# Altium schematic sheet SOC - MCU DOMAIN.SchDoc
size A2; DocumentNumber: 7; SheetNumber: 8; SheetTotal: 14
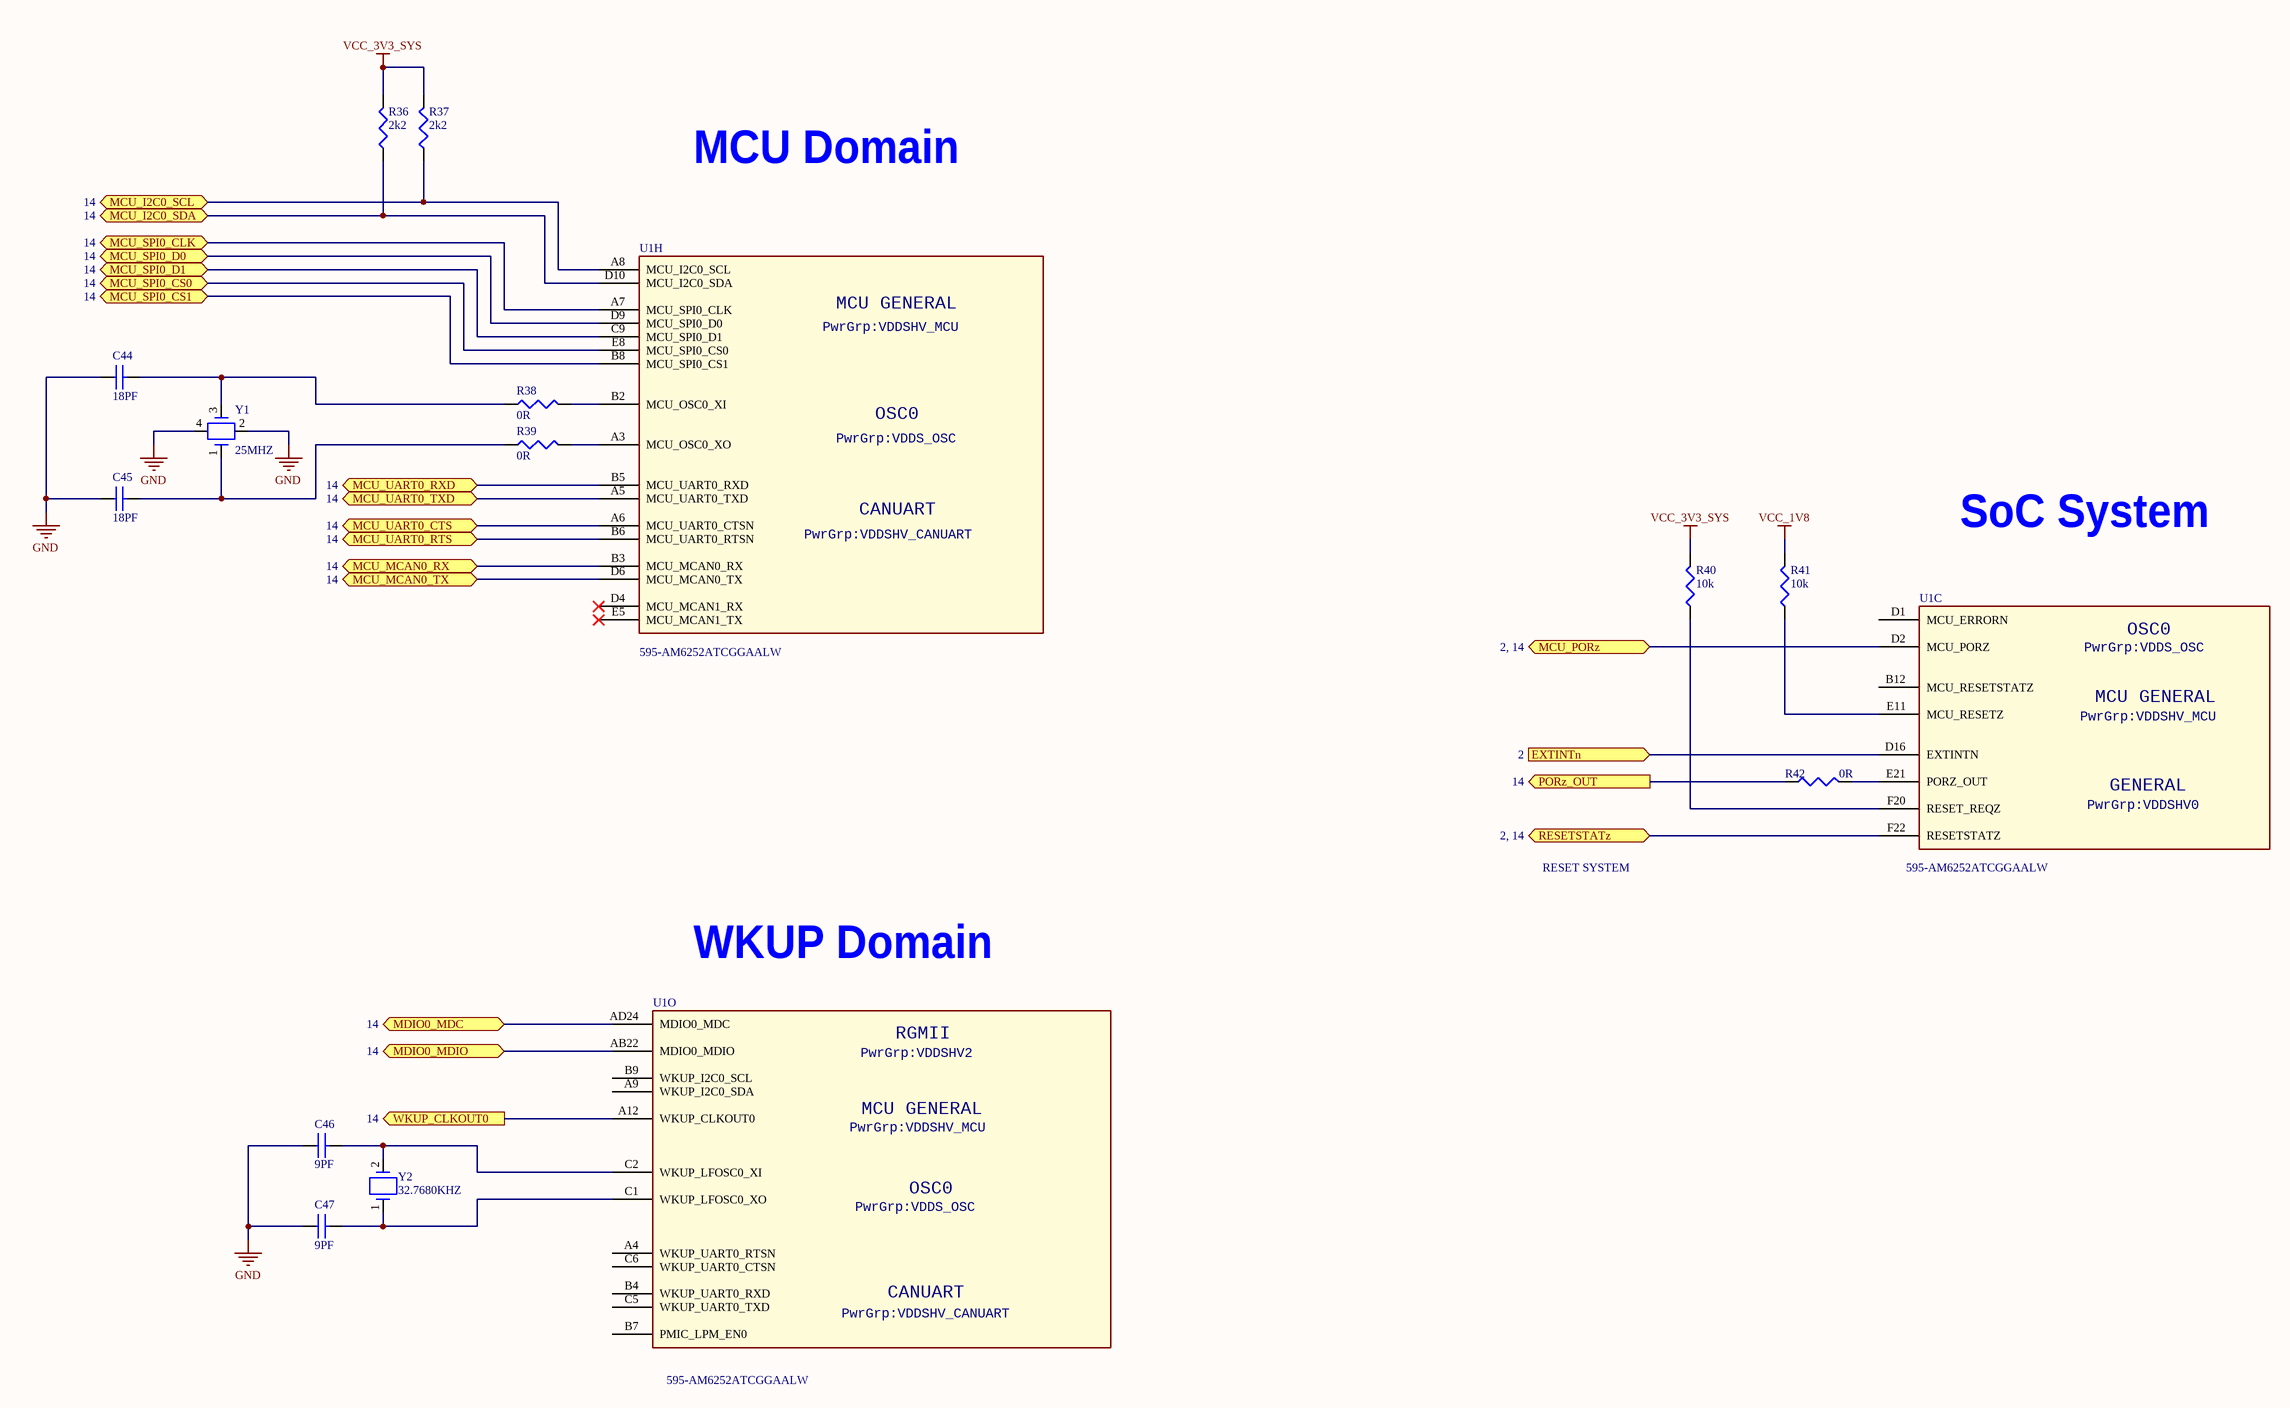
[diagram p0: SOC - MCU DOMAIN.SchDoc]

## Parts
C44  18PF  [C0402]
C45  18PF  [C0402]
C46  9PF  [C0402]
C47  9PF  [C0402]
R36  2k2  [R0402]
R37  2k2  [R0402]
R38  0R  [R0402]
R39  0R  [R0402]
R40  10k  [R0201]
R41  10k  [R0201]
R42  0R  [R0402]
U1  Supplier Part Number 1: 595-AM6252ATCGGAALW  [BGA425C50P25X25_1300X1300X89]  (hidden comment: AM62-EVM_BGA425)  (parts C,H,O of 18)
Y1  25MHZ  [XRCGB25M000F3M00R0]
Y2  32.7680KHZ  [ECS327934QSTR]

## Ports
EXTINTn (in, see 2), MCU_I2C0_SCL (bidir, see 14), MCU_I2C0_SDA (bidir, see 14), MCU_MCAN0_RX (bidir, see 14), MCU_MCAN0_TX (bidir, see 14), MCU_PORz (bidir, see 2, 14), MCU_SPI0_CLK (bidir, see 14), MCU_SPI0_CS0 (bidir, see 14), MCU_SPI0_CS1 (bidir, see 14), MCU_SPI0_D0 (bidir, see 14), MCU_SPI0_D1 (bidir, see 14), MCU_UART0_CTS (bidir, see 14), MCU_UART0_RTS (bidir, see 14), MCU_UART0_RXD (bidir, see 14), MCU_UART0_TXD (bidir, see 14), MDIO0_MDC (bidir, see 14), MDIO0_MDIO (bidir, see 14), PORz_OUT (out, see 14), RESETSTATz (bidir, see 2, 14), WKUP_CLKOUT0 (out, see 14)

## Nets
GND: C44.1 C45.1 C46.1 C47.1 Y1.2 Y1.4
VCC_1V8: R41.2
VCC_3V3_SYS: R36.2 R37.2 R40.2
EXTINTn: U1.D16(EXTINTN) ; port EXTINTn
MCU_I2C0_SCL: R37.1 U1.A8(MCU_I2C0_SCL) ; port MCU_I2C0_SCL
MCU_I2C0_SDA: R36.1 U1.D10(MCU_I2C0_SDA) ; port MCU_I2C0_SDA
MCU_MCAN0_RX: U1.B3(MCU_MCAN0_RX) ; port MCU_MCAN0_RX
MCU_MCAN0_TX: U1.D6(MCU_MCAN0_TX) ; port MCU_MCAN0_TX
MCU_PORz: U1.D2(MCU_PORZ) ; port MCU_PORz
MCU_SPI0_CLK: U1.A7(MCU_SPI0_CLK) ; port MCU_SPI0_CLK
MCU_SPI0_CS0: U1.E8(MCU_SPI0_CS0) ; port MCU_SPI0_CS0
MCU_SPI0_CS1: U1.B8(MCU_SPI0_CS1) ; port MCU_SPI0_CS1
MCU_SPI0_D0: U1.D9(MCU_SPI0_D0) ; port MCU_SPI0_D0
MCU_SPI0_D1: U1.C9(MCU_SPI0_D1) ; port MCU_SPI0_D1
MCU_UART0_CTS: U1.A6(MCU_UART0_CTSN) ; port MCU_UART0_CTS
MCU_UART0_RTS: U1.B6(MCU_UART0_RTSN) ; port MCU_UART0_RTS
MCU_UART0_RXD: U1.B5(MCU_UART0_RXD) ; port MCU_UART0_RXD
MCU_UART0_TXD: U1.A5(MCU_UART0_TXD) ; port MCU_UART0_TXD
MDIO0_MDC: U1.AD24(MDIO0_MDC) ; port MDIO0_MDC
MDIO0_MDIO: U1.AB22(MDIO0_MDIO) ; port MDIO0_MDIO
PORz_OUT: R42.1 ; port PORz_OUT
RESETSTATz: U1.F22(RESETSTATZ) ; port RESETSTATz
WKUP_CLKOUT0: U1.A12(WKUP_CLKOUT0) ; port WKUP_CLKOUT0
NetC44_2: C44.2 R38.1 Y1.3
NetC45_2: C45.2 R39.1 Y1.1
NetC46_2: C46.2 U1.C2(WKUP_LFOSC0_XI) Y2.2
NetC47_2: C47.2 U1.C1(WKUP_LFOSC0_XO) Y2.1
NetR38_2: R38.2 U1.B2(MCU_OSC0_XI)
NetR39_2: R39.2 U1.A3(MCU_OSC0_XO)
NetR40_1: R40.1 U1.F20(RESET_REQZ)
NetR41_1: R41.1 U1.E11(MCU_RESETZ)
NetR42_2: R42.2 U1.E21(PORZ_OUT)

Not connected (* = marked no-connect by the designer): U1 A4(WKUP_UART0_RTSN) A9(WKUP_I2C0_SDA) B4(WKUP_UART0_RXD) B7(PMIC_LPM_EN0) B9(WKUP_I2C0_SCL) B12(MCU_RESETSTATZ) C5(WKUP_UART0_TXD) C6(WKUP_UART0_CTSN) D1(MCU_ERRORN) D4(MCU_MCAN1_RX)* E5(MCU_MCAN1_TX)*

## Notes on the sheet
- MCU Domain
- SoC System
- RESET SYSTEM
- WKUP Domain
- (in symbol AM62-EVM_BGA425, part C) OSC0; PwrGrp:VDDS_OSC; MCU GENERAL; PwrGrp:VDDSHV_MCU; GENERAL; PwrGrp:VDDSHV0
- (in symbol AM62-EVM_BGA425, part H) MCU GENERAL; PwrGrp:VDDSHV_MCU; OSC0; PwrGrp:VDDS_OSC; CANUART; PwrGrp:VDDSHV_CANUART
- (in symbol AM62-EVM_BGA425, part O) RGMII; PwrGrp:VDDSHV2; MCU GENERAL; PwrGrp:VDDSHV_MCU; OSC0; PwrGrp:VDDS_OSC; CANUART; PwrGrp:VDDSHV_CANUART

## Library data of the parts
C44 C45 = GJM1555C1H180JB01D: CAP CER 18PF 50V C0G/NP0 0402; Manufacturer: Murata; Tolerance: 5%; Dielectric: C0G; Supplier 1: Digi-Key; Manufacturer Part Number: GJM1555C1H180JB01D; Stock 1: 411624; Pricing 1: 1=0.15, 10=0.109, 50=0.0622, 100=0.0515, 500=0.0361, 1000=0.0299, 2500=0.0278, 5000=0.0254 (USD); Mount: Surface Mount; Case/Package: 0402; Case Code (Imperial): 0402; Case Code (Metric): 1005; Min Operating Temperature: -55°C; Max Operating Temperature: 125°C; Capacitance: 18pF; Packaging: Tape and Reel; Voltage Rating: 50V; Package Quantity: 1; Termination: SMD/SMT; Voltage: 50V; Voltage Rating (DC): 50V; Series: GJM; Construction: Flat; Length: 1mm; Width: 0.02inch; Height: 0.5mm; Thickness: 0.022inch; Depth: 0.5mm; Radiation Hardening: No; Lead Free: Lead Free; RoHS Compliant: Yes; ComponentLink1URL: https://datasheet.ciiva.com/156/product-156024.pdf?src-supplier=Digi-Key; ComponentLink1Description: https://datasheet.ciiva.com/156/product-156024.pdf?src-supplier=Digi-Key; ComponentLink2URL: https://datasheet.ciiva.com/18183/getdatasheetpartid-500953-18183813.pdf?src-supplier=Verical; ComponentLink2Description: https://datasheet.ciiva.com/18183/getdatasheetpartid-500953-18183813.pdf?src-supplier=Verical; ComponentLink3URL: https://datasheet.ciiva.com/156/partnumbering-e-01-156025.pdf?src-supplier=Digi-Key; ComponentLink3Description: https://datasheet.ciiva.com/156/partnumbering-e-01-156025.pdf?src-supplier=Digi-Key; ComponentLink4URL: https://datasheet.ciiva.com/156/partnumbering-e-01-156026.pdf?src-supplier=Digi-Key; ComponentLink4Description: https://datasheet.ciiva.com/156/partnumbering-e-01-156026.pdf?src-supplier=Digi-Key; Supplier Part Number 1: 490-3119-6-ND
C46 C47 = GJM1555C1H9R0DB01D: CAP CER 9PF 50V C0G/NP0 0402; Manufacturer: Murata; Dielectric: C0G; Supplier 1: Digi-Key; Manufacturer Part Number: GJM1555C1H9R0DB01D; Stock 1: 0; Pricing 1: 10000=0.0082, 20000=0.0078, 30000=0.0074, 50000=0.0067, 100000=0.0054, 250000=0.0052 (USD); Mount: Surface Mount; Case/Package: 0402; Case Code (Metric): 1005; Case Code (Imperial): 0402; Min Operating Temperature: -55°C; Max Operating Temperature: 125°C; Capacitance: 9pF; Packaging: Tape and Reel; Package Quantity: 10000; Voltage Rating: 50V; Termination: SMD/SMT; Voltage Rating (DC): 50V; Series: GJM; Construction: Flat; Length: 1mm; Width: 0.02inch; Height: 0.5mm; Thickness: 0.022inch; Depth: 0.5mm; Radiation Hardening: No; RoHS Compliant: Yes; ComponentLink1URL: https://datasheet.ciiva.com/164/product-164917.pdf?src-supplier=Digi-Key; ComponentLink1Description: https://datasheet.ciiva.com/164/product-164917.pdf?src-supplier=Digi-Key; ComponentLink2URL: https://datasheet.ciiva.com/11609/product-11609467.pdf?src-supplier=Avnet; ComponentLink2Description: https://datasheet.ciiva.com/11609/product-11609467.pdf?src-supplier=Avnet; Supplier Part Number 1: 490-14793-2-ND
R36 R37 = RC0402FR-072K2L: RES 2.20K OHM 1/16W 1% 0402 SMD; Manufacturer: Yageo; Resistance (Ohms): 2.2K; Power (Watts): 0.063W, 1/16W; .Checked PCB: used; Temperature Coefficient: ±100ppm/°C; Category: Resistors; Supplier Part Number: 311-2.20KLRCT-ND; Manufacturer Part Number: RC0402FR-072K2L; Package / Case: 0402 (1005 Metric); Price 1k [$]: 0.01421; Tolerance: ±1%; Value: 2k2; .Checked SCH: used; Supplier: Digikey; Supplier 1: Digi-Key; Supplier Part Number 1: 311-2.20KLRCT-ND; RoHS: RoHS Compliant; Stock 1: 195154; Pricing 1: 10=0.014, 50=0.0104, 100=0.0079, 250=0.00584, 500=0.00432, 1000=0.00288 (USD); Composition: Thick Film; Features: -; Size / Dimension: 0.039" L x 0.020" W (1.00mm x 0.50mm); Height: 0.016" (0.40mm); Number of Terminations: 2; Packaging: Cut Tape (CT); ComponentLink1URL: http://www.yageo.com/documents/recent/PYu-RC0402_51_RoHS_L_6.pdf; ComponentLink1Description: http://www.yageo.com/documents/recent/PYu-RC0402_51_RoHS_L_6.pdf
R38 R39 R42 = RC0402JR-070RL: RES 0.0 OHM 1/16W 0402 SMD; Manufacturer: Yageo; Resistance (Ohms): 0.0; Power (Watts): 0.063W, 1/16W; Tolerance: Jumper; .Checked PCB: used; Category: Resistors; Supplier Part Number: 311-0.0JRCT-ND; Manufacturer Part Number: RC0402JR-070RL; Package / Case: 0402 (1005 Metric); Price 1k [$]: 0.01389; Value: 0R; .Checked SCH: used; Supplier: Digikey; Supplier 1: Digi-Key; Supplier Part Number 1: 311-0.0JRCT-ND; RoHS: RoHS Compliant; Stock 1: 1106330; Pricing 1: 10=0.012, 50=0.009, 100=0.0069, 250=0.00512, 500=0.0038, 1000=0.00253 (USD); Composition: Thick Film; Features: -; Temperature Coefficient: -; Size / Dimension: 0.039" L x 0.020" W (1.00mm x 0.50mm); Height: 0.016" (0.40mm); Number of Terminations: 2; Packaging: Cut Tape (CT); ComponentLink1URL: http://www.yageo.com/documents/recent/PYu-RC0402_51_RoHS_L_6.pdf; ComponentLink1Description: http://www.yageo.com/documents/recent/PYu-RC0402_51_RoHS_L_6.pdf
R40 R41 = RC0201FR-0710KL: RES 10K OHM 1/20W 1% 0201 SMD; Manufacturer: Yageo; Power (Watts): 0.05W, 1/20W; Temperature Coefficient: ±200ppm/°C; .Creator: MM; Supplier 1: Digi-Key; Manufacturer Part Number: RC0201FR-0710KL; RoHS: RoHS Compliant; Category: Resistors; Stock 1: 529049; Pricing 1: 1=0.1, 10=0.074, 25=0.054, 100=0.0303, 250=0.02312, 500=0.0185, 1000=0.01361, 2500=0.01182, 5000=0.00976 (USD); Packaging: Cut Tape (CT); Resistance (Ohms): 10k; Tolerance: ±1%; Composition: Thick Film; Features: Moisture Resistant; Package / Case: 0201 (0603 Metric); Supplier Device Package: 0201; Size / Dimension: 0.024" L x 0.012" W (0.60mm x 0.30mm); Height: 0.010" (0.26mm); Number of Terminations: 2; ComponentLink1URL: http://www.yageo.com/documents/recent/PYu-RC0201_51_RoHS_L_8.pdf; ComponentLink1Description: http://www.yageo.com/documents/recent/PYu-RC0201_51_RoHS_L_8.pdf; Supplier Part Number 1: 311-10.0KMCT-ND; .Checked PCB: MM; .Checked SCH: MM
U1 = AM62-EVM_BGA425: ARM® Cortex®-A53 Microprocessor IC Sitara™ 2 Core, 64-Bit 1.4GHz 425-FCCSP (13x13); Manufacturer: Texas Instruments; Manufacturer Part Number: AM6252ATCGGAALW; Supplier 1: Mouser; Stock 1: 0; Pricing 1: 1=21.23, 10=19.58, 50=18.7, 100=18.7, 1000=15.94, 10000=15.94 (USD)
Y1 = XRCGB25M000F3M00R0: CRYSTAL 25.0000MHZ 6PF SMD; Manufacturer: Murata; ESR (Equivalent Series Resistance): 150R; Frequency Tolerance: 30ppm; Frequency Stability: 40ppm; Supplier 1: Digi-Key; Manufacturer Part Number: XRCGB25M000F3M00R0; Stock 1: 131079; Pricing 1: 1=0.31, 10=0.256, 50=0.2306, 100=0.205, 500=0.1948, 1000=0.164 (USD); Mount: Surface Mount; Case/Package: SMD/SMT; Number of Pins: 4; Min Operating Temperature: -30°C; Max Operating Temperature: 85°C; Frequency: 25MHz; Load Capacitance: 6pF; Packaging: Tape and Reel; Tolerance: 30ppm; Package Quantity: 1; Termination: SMD/SMT; Series Resistance: 150R; Series: XRCGB; Length: 2mm; Width: 1.6mm; Height: 0.028inch; Depth: 1.6mm; Reach SVHC Compliant: Yes; Lead Free: Lead Free; RoHS Compliant: Yes; ComponentLink1URL: https://datasheet.ciiva.com/18026/getdatasheetpartid-711202-18026505.pdf?src-supplier=Verical; ComponentLink1Description: https://datasheet.ciiva.com/18026/getdatasheetpartid-711202-18026505.pdf?src-supplier=Verical; ComponentLink2URL: https://datasheet.ciiva.com/1361/p79e-1361519.pdf?src-supplier=Element14; ComponentLink2Description: https://datasheet.ciiva.com/1361/p79e-1361519.pdf?src-supplier=Element14; ComponentLink3URL: https://datasheet.ciiva.com/22695/p79e-22695438.pdf?src-supplier=Element14; ComponentLink3Description: https://datasheet.ciiva.com/22695/p79e-22695438.pdf?src-supplier=Element14; ComponentLink4URL: https://datasheet.ciiva.com/852/p79e-852299.pdf?src-supplier=Digi-Key; ComponentLink4Description: https://datasheet.ciiva.com/852/p79e-852299.pdf?src-supplier=Digi-Key; ComponentLink5URL: https://datasheet.ciiva.com/852/p79e-852298.pdf?src-supplier=Digi-Key; ComponentLink5Description: https://datasheet.ciiva.com/852/p79e-852298.pdf?src-supplier=Digi-Key; ComponentLink6URL: https://datasheet.ciiva.com/852/p79e-852300.pdf?src-supplier=Digi-Key; ComponentLink6Description: https://datasheet.ciiva.com/852/p79e-852300.pdf?src-supplier=Digi-Key; Supplier Part Number 1: 490-5578-6-ND
Y2 = ECS-.327-9-34QCS-TR: CRYSTAL 32.7680KHZ 9PF SMD; Manufacturer: ECS International; Frequency: 32.768kHz; ESR (Equivalent Series Resistance): 70kR; Frequency Tolerance: 10ppm; Supplier 1: Digi-Key; Manufacturer Part Number: ECS-.327-9-34QCS-TR; Stock 1: 45000; Pricing 1: 3000=0.5643, 6000=0.5448, 15000=0.5254 (USD); Mount: Surface Mount; Case/Package: SMD/SMT; Min Operating Temperature: -40°C; Max Operating Temperature: 125°C; Packaging: Cut Tape; Load Capacitance: 9pF; Series: ECX-34Q; Length: 0.126inch; Width: 0.061inch; Height: 0.035inch; Ratings: AEC-Q200; ComponentLink1URL: https://www.ecsxtal.com/store/pdf/ECX-34Q.pdf?src-supplier=Digi-Key; ComponentLink1Description: https://www.ecsxtal.com/store/pdf/ECX-34Q.pdf?src-supplier=Digi-Key; ComponentLink2URL: http://www.ecsxtal.com/store/pdf/partnumber4.pdf?src-supplier=Digi-Key; ComponentLink2Description: http://www.ecsxtal.com/store/pdf/partnumber4.pdf?src-supplier=Digi-Key; ComponentLink3URL: https://datasheet.octopart.com/ECS-.327-9-34QCS-TR-ECS-International-datasheet-101745702.pdf?src-supplier=Master+Electronics; ComponentLink3Description: https://datasheet.octopart.com/ECS-.327-9-34QCS-TR-ECS-International-datasheet-101745702.pdf?src-supplier=Master+Electronics; Supplier Part Number 1: XC2160TR-ND